# Altium schematic sheet Fixed_Delay_Line.SchDoc
size A4; ApprovedBy: Mateusz Kowalik; CheckedBy: Mateusz Kowalik; Author: Mateusz Kowalik; CompanyName: InMotion Labs sp. z o.o.; DrawnBy: Mateusz Kowalik; Engineer: Mateusz Kowalik; Organization: InMotion Labs sp. z o.o.; Address1: Rydlówka 5A; Address2: 30-363 Kraków; Address4: Poland; Revision: Rev 0; SheetNumber: 9; SheetTotal: 18
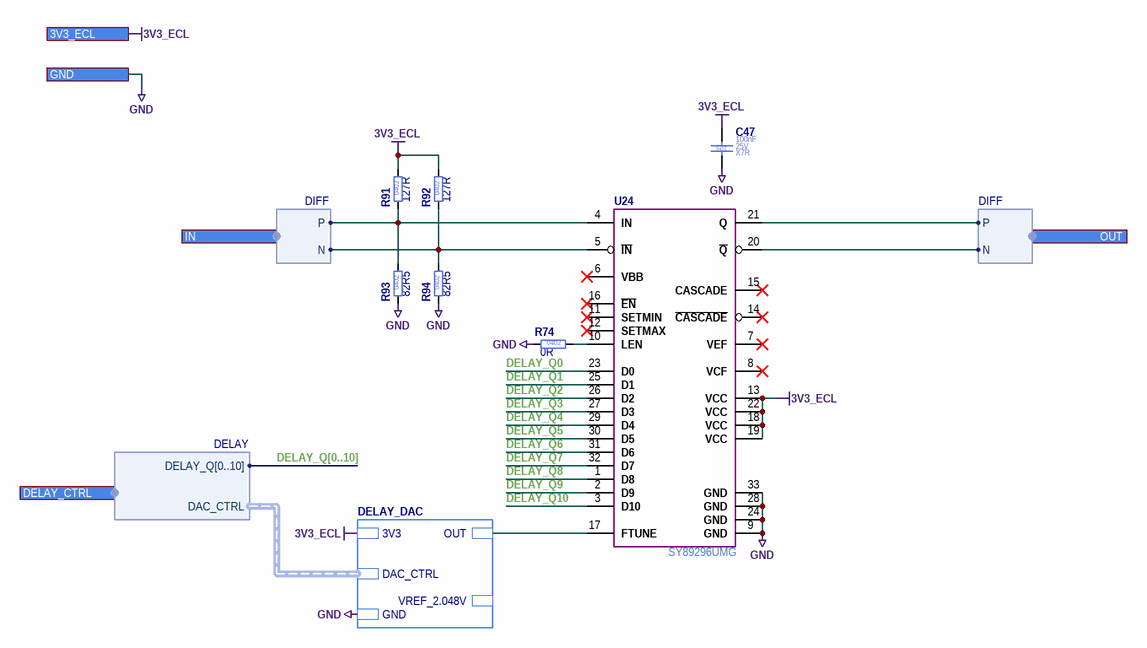
[diagram p0: Fixed_Delay_Line.SchDoc]

## Parts
C47  Case/Package: 0402  Voltage Rating (DC): 25V  Dielectric: X7R  Capacitance: 100nF  [C_0402_1005]  (hidden comment: C_100NF_25V_X7R_0402_10)
R74  Resistance: 0R  Case/Package: 0402  [R_0402_1005]  (hidden comment: R_0R_0402_1)
R91  Resistance: 127R  Case/Package: 0402  [R_0402_1005]  (hidden comment: R_127R_0402_1)
R92  Resistance: 127R  Case/Package: 0402  [R_0402_1005]  (hidden comment: R_127R_0402_1)
R93  Resistance: 82R5  Case/Package: 0402  [R_0402_1005]  (hidden comment: R_82R5_0402_1)
R94  Resistance: 82R5  Case/Package: 0402  [R_0402_1005]  (hidden comment: R_82R5_0402_1)
U24  SY89296UMG  [QFN50P500X500X100_HS-33N]

## Sub-sheets
DELAY_DAC = DAC_12bit.SchDoc: 3V3, DAC_CTRL (harness DAC), VREF_2.048V, OUT, GND

## Ports
3V3_ECL, DELAY_CTRL (harness DELAY), GND, IN (harness DIFF), OUT (harness DIFF)

## Harnesses
DIFF: P, N
DELAY: DELAY_Q[0..10], DAC_CTRL

## Nets
3V3_ECL: C47.1 R91.2 R92.2 U24.13(VCC) U24.18(VCC) U24.19(VCC) U24.22(VCC) ; port 3V3_ECL, sheet DELAY_DAC/3V3
GND: C47.2 R74.1 R93.1 R94.1 U24.9(GND) U24.24(GND) U24.28(GND) U24.33(GND) ; port GND, sheet DELAY_DAC/GND
DELAY_Q0: U24.23(D0)
DELAY_Q1: U24.25(D1)
DELAY_Q2: U24.26(D2)
DELAY_Q3: U24.27(D3)
DELAY_Q4: U24.29(D4)
DELAY_Q5: U24.30(D5)
DELAY_Q6: U24.31(D6)
DELAY_Q7: U24.32(D7)
DELAY_Q8: U24.1(D8)
DELAY_Q9: U24.2(D9)
DELAY_Q10: U24.3(D10)
NetR74_2: R74.2 U24.10(LEN)
NetR91_1: R91.1 R93.2 U24.4(IN) ; port IN.P
NetR92_1: R92.1 R94.2 U24.5(~{IN}) ; port IN.N
NetU24_17: U24.17(FTUNE) ; sheet DELAY_DAC/OUT
NetU24_20: U24.20(~{Q}) ; port OUT.N
NetU24_21: U24.21(Q) ; port OUT.P

Not connected (* = marked no-connect by the designer): U24 6(VBB)* 7(VEF)* 8(VCF)* 11(SETMIN)* 12(SETMAX)* 14(~{CASCADE})* 15(CASCADE)* 16(~{EN})*

## Buses and harness runs
bus DELAY_Q[0..10]

## Notes on the sheet
- Title
- Size:
- Date:
- A4

## Library data of the parts
C47 = C_100NF_25V_X7R_0402_10: Ceramic Capacitor; Manufacturer Part Number: EMK105B7104KV-F; Manufacturer: Taiyo Yuden; Value: 100nF; Tolerance: 10%; Part Number: C_100NF_25V_X7R_0402_10; Mount: Surface Mount; Height: 500um; HelpURL: https://pl.mouser.com/datasheet/2/396/mlcc02_e-1307760.pdf; RoHS: Compliant; Max Operating Temperature: 125°C; Status: AK; Supplier 1: Mouser; Supplier Part Number 1: 963-EMK105B7104KV-F
R74 = R_0R_0402_1: Thick Film Resistor; Manufacturer: Yageo; Manufacturer Part Number: RC0402FR-070RL; Value: 0R; Tolerance: 1%; Voltage Rating (DC): 50V; Power Rating: 63mW; Stats: MK; Part Number: R_0R_0402_1; Mount: Surface Mount; Height: 350um; HelpURL: http://datasheet.octopart.com/2176049-1-TE-Connectivity---AMP-datasheet-11120217.pdf; RoHS: Compliant; Max Operating Temperature: 155°C; Supplier 1: Mouser; Supplier Part Number 1: 603-RC0402FR-070RL
R91 R92 = R_127R_0402_1: Thick Film Resistor; Manufacturer: Yageo; Manufacturer Part Number: RC0402FR-07127RL; Value: 127R; Tolerance: 1%; Voltage Rating (DC): 50V; Power Rating: 63mW; Stats: MK; Part Number: R_127R_0402_1; Mount: Surface Mount; Height: 350um; HelpURL: https://pl.mouser.com/datasheet/2/447/PYu_RC_Group_51_RoHS_L_10-1664068.pdf; RoHS: Compliant; Max Operating Temperature: 155°C; Supplier 1: Mouser; Supplier Part Number 1: 603-RC0402FR-07127RL
R93 R94 = R_82R5_0402_1: Thick Film Resistor; Manufacturer: Yageo; Manufacturer Part Number: RC0402FR-0782R5L; Value: 82R5; Tolerance: 1%; Voltage Rating (DC): 50V; Power Rating: 63mW; Stats: MK; Part Number: R_82R5_0402_1; Mount: Surface Mount; Height: 350um; HelpURL: https://pl.mouser.com/datasheet/2/447/PYu-RC_Group_51_RoHS_L_10-1527934.pdf; RoHS: Compliant; Max Operating Temperature: 155°C; Supplier 1: Mouser; Supplier Part Number 1: 603-RC0402FR-0782R5L
U24 = SY89296UMG: Delay Lines/Timing Elements 2.5V/3.3V PECL Delay Line; Manufacturer: Microchip; Max Frequency: 1.5GHz; Max Supply Current: 220mA; Max Supply Voltage: 3.6V; Min Supply Voltage: 2.375V; Part Number: SY89296UMG; Case/Package: QFN32; Mount: Surface Mount; Height: 0.9mm; HelpURL: https://datasheet.octopart.com/SY89296UTG-Microchip-datasheet-11975343.pdf; Logic Function: Delay Line; Marking: SY89296U; Max Operating Temperature: 85°C; Number of Pins: 32; RoHS: Compliant; Status: MK; Manufacturer Part Number: SY89296UMG; Supplier 1: Mouser; Supplier Part Number 1: 998-SY89296UMG